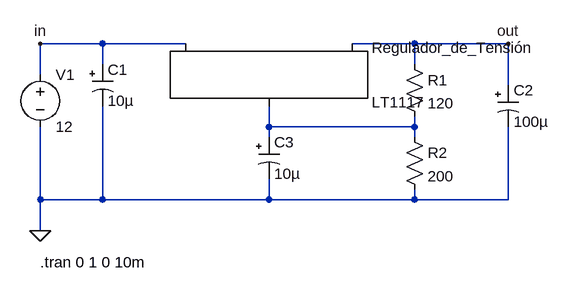
[diagram p0: schematic Regulador de Tensión_LM1117.asc]
Regulador de Tensión_LM1117.asc, the LTspice schematic file:
Version 4
SHEET 1 880 680
WIRE -32 160 -128 160
WIRE 96 160 -32 160
WIRE 448 160 352 160
WIRE 592 160 448 160
WIRE -32 192 -32 160
WIRE 448 192 448 160
WIRE -128 208 -128 160
WIRE 592 224 592 160
WIRE 224 288 224 256
WIRE 448 288 448 272
WIRE 448 288 224 288
WIRE 224 304 224 288
WIRE 448 304 448 288
WIRE -128 400 -128 288
WIRE -32 400 -32 256
WIRE -32 400 -128 400
WIRE 224 400 224 368
WIRE 224 400 -32 400
WIRE 448 400 448 384
WIRE 448 400 224 400
WIRE 592 400 592 288
WIRE 592 400 448 400
WIRE -128 448 -128 400
FLAG -128 448 0
FLAG -128 160 in
FLAG 592 160 out
SYMBOL PowerProducts\\LT1117 224 160 R0
SYMATTR InstName Regulador_de_Tensión
SYMBOL polcap -48 192 R0
WINDOW 3 24 56 Left 2
SYMATTR InstName C1
SYMATTR Value 10µ
SYMATTR Description Capacitor
SYMATTR Type cap
SYMATTR SpiceLine V=16 Irms=1.69 Rser=0.034 Lser=0 mfg="Chemi-Con" pn="LXF16VB152M12X20LL" type="Al electrolytic"
SYMBOL polcap 576 224 R0
WINDOW 3 24 56 Left 2
SYMATTR InstName C2
SYMATTR Value 100µ
SYMATTR Description Capacitor
SYMATTR Type cap
SYMATTR SpiceLine V=16 Irms=1.69 Rser=0.034 Lser=0 mfg="Chemi-Con" pn="LXF16VB152M12X20LL" type="Al electrolytic"
SYMBOL polcap 208 304 R0
WINDOW 3 24 56 Left 2
SYMATTR InstName C3
SYMATTR Value 10µ
SYMATTR Description Capacitor
SYMATTR Type cap
SYMATTR SpiceLine V=16 Irms=1.69 Rser=0.034 Lser=0 mfg="Chemi-Con" pn="LXF16VB152M12X20LL" type="Al electrolytic"
SYMBOL voltage -128 192 R0
SYMATTR InstName V1
SYMATTR Value 12
SYMBOL res 432 176 R0
SYMATTR InstName R1
SYMATTR Value 120
SYMBOL res 432 288 R0
SYMATTR InstName R2
SYMATTR Value 200
TEXT -128 496 Left 2 !.tran 0 1 0 10m

The netlist it stands for:
* Regulador de Tensión_LM1117.asc
XRegulador_de_Tensión N001 out in LT1117
C1 in 0 10µ V=16 Irms=1.69 Rser=0.034 Lser=0 mfg="Chemi-Con" pn="LXF16VB152M12X20LL" type="Al electrolytic"
C2 out 0 100µ V=16 Irms=1.69 Rser=0.034 Lser=0 mfg="Chemi-Con" pn="LXF16VB152M12X20LL" type="Al electrolytic"
C3 N001 0 10µ V=16 Irms=1.69 Rser=0.034 Lser=0 mfg="Chemi-Con" pn="LXF16VB152M12X20LL" type="Al electrolytic"
V1 in 0 12
R1 out N001 120
R2 N001 0 200
.tran 0 1 0 10m
.lib LT1117.lib
.backanno
.end